# EAGLE design schematics (EAGLE 9.6.0)
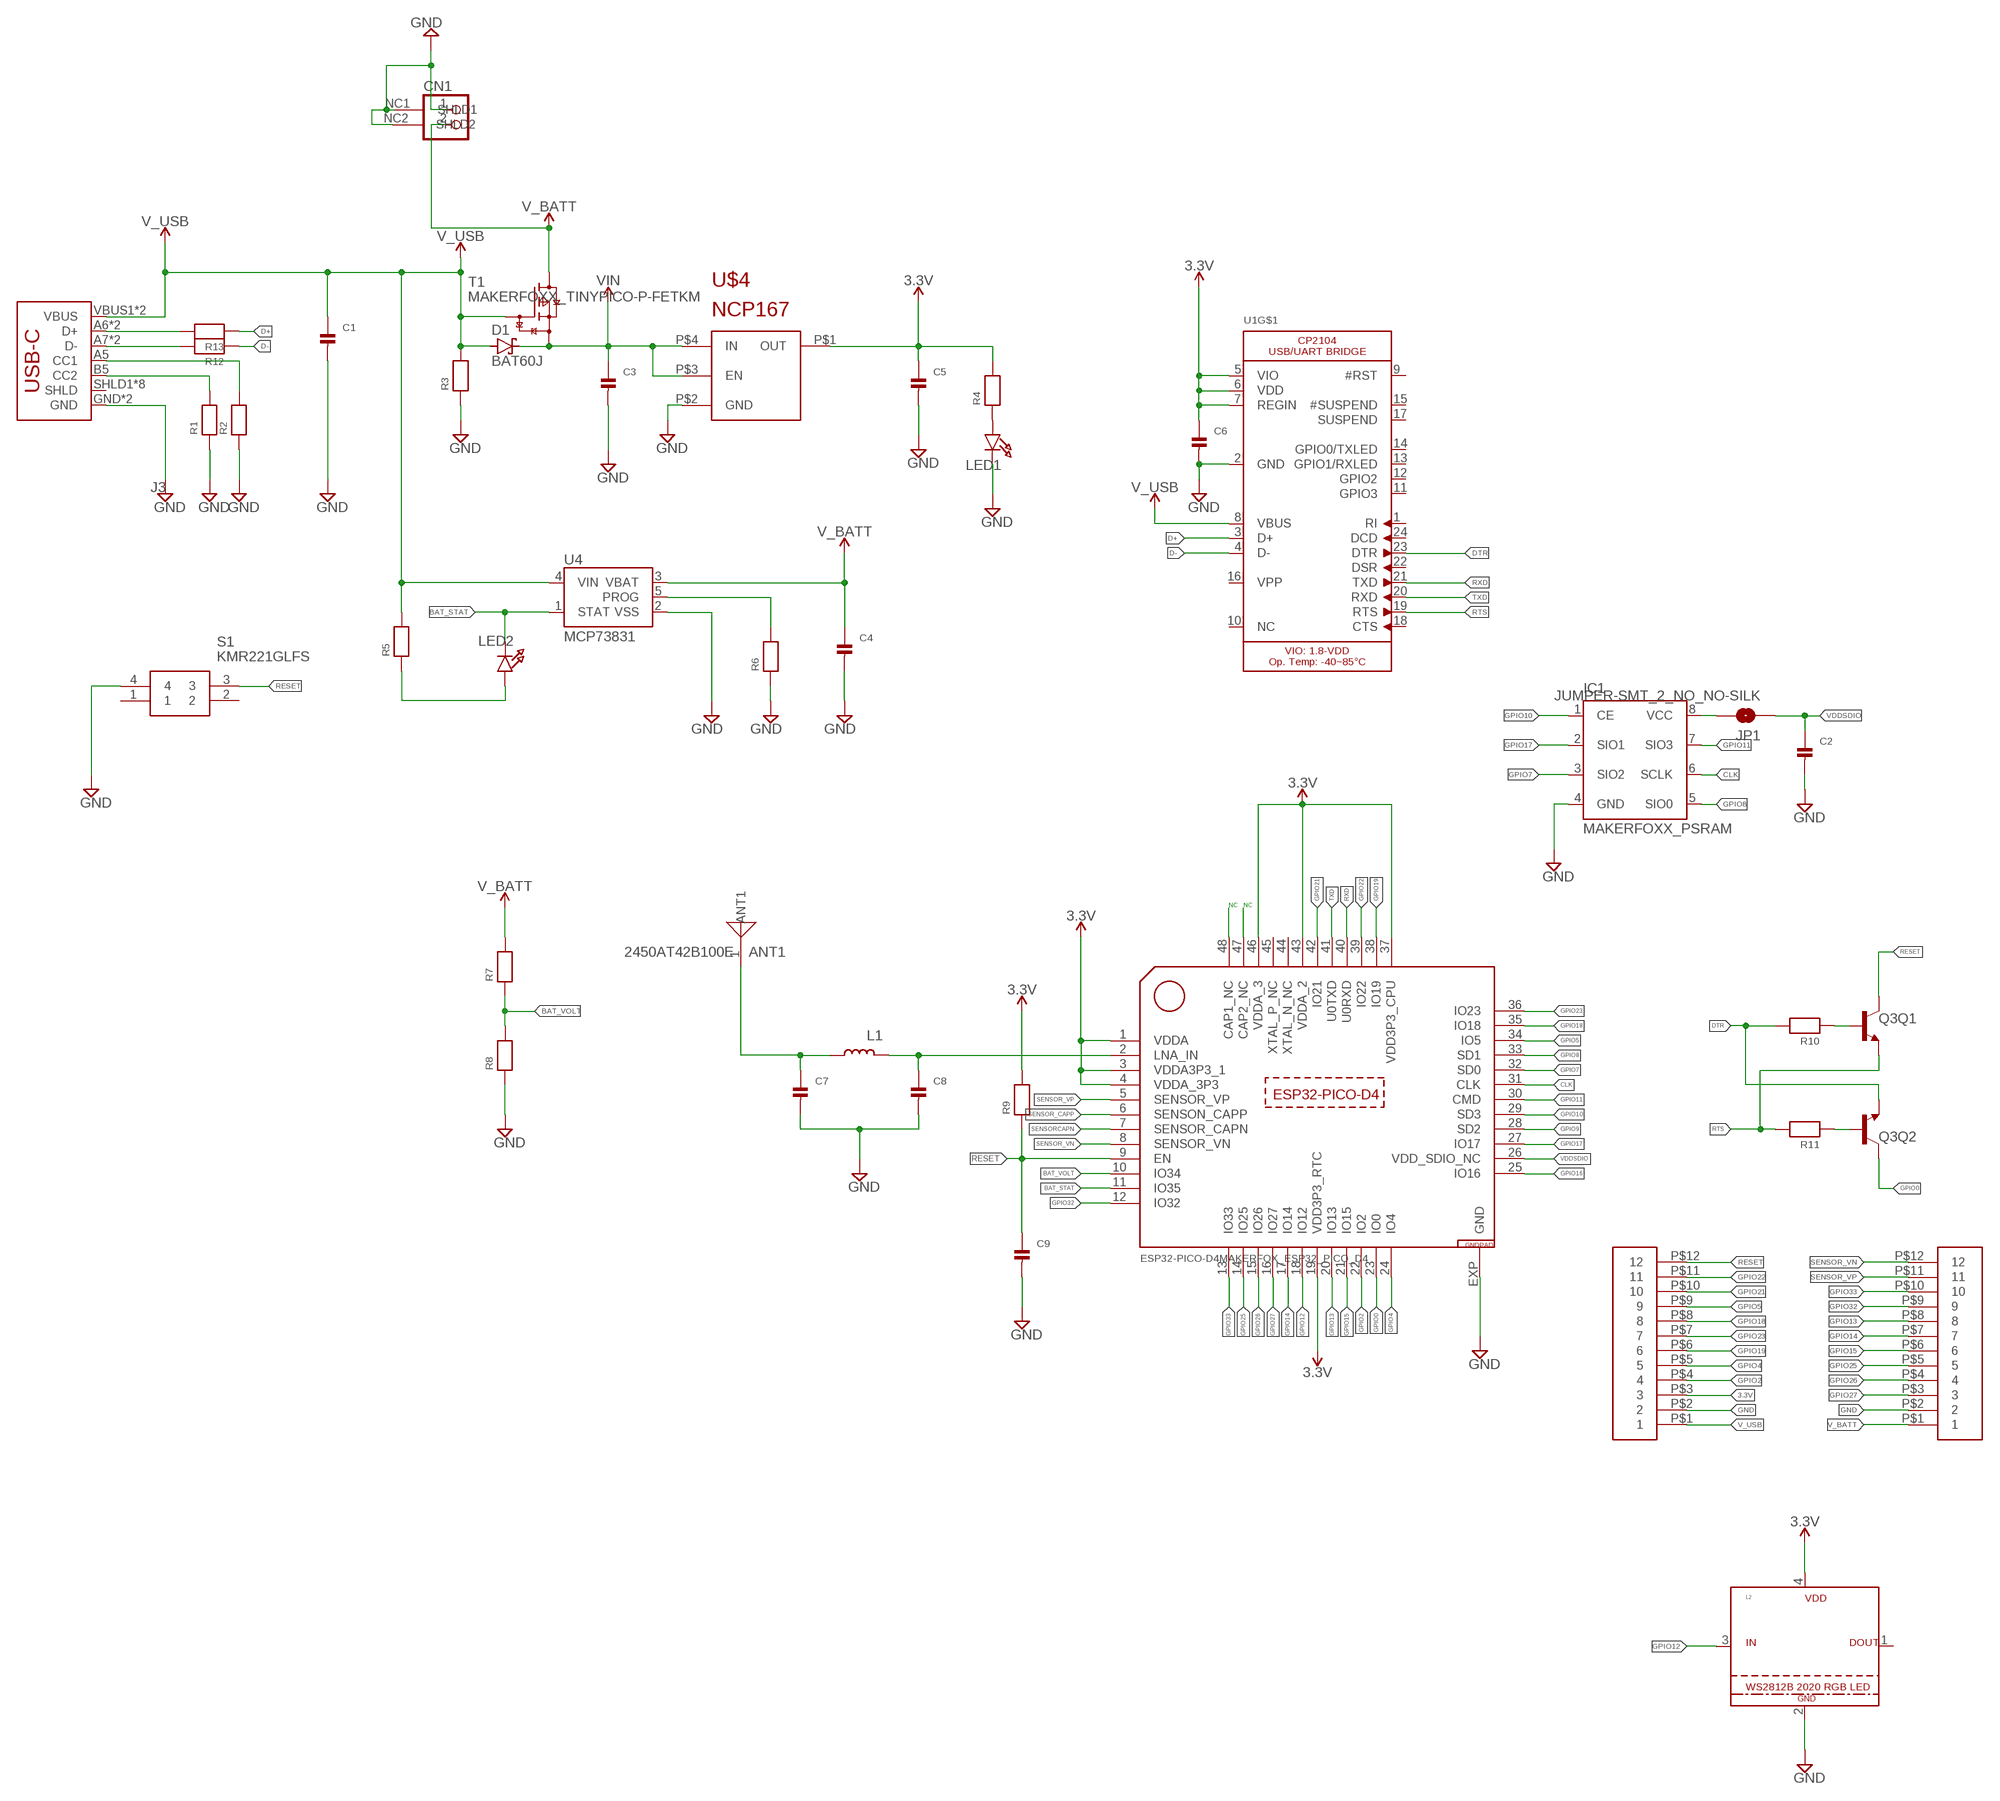
[diagram p0: schematic, sheet 1]

## Parts
ANT1  2450AT42B100E  [2450AT42B100E]
C1  CAP_CERAMIC_0603MP  [_0603MP]
C2  CAP_CERAMIC_0402MP  [_0402MP]
C3  CAP_CERAMIC_0402MP  [_0402MP]
C4  CAP_CERAMIC_0402MP  [_0402MP]
C5  CAP_CERAMIC_0402MP  [_0402MP]
C6  CAP_CERAMIC_0603MP  [_0603MP]
C7  CAP_CERAMIC_0402MP  [_0402MP]
C8  CAP_CERAMIC_0402MP  [_0402MP]
C9  CAP_CERAMIC_0402MP  [_0402MP]
CN1  STANDARD_JST_2PINSH2  [MAKERFOXX_JSTSH2]
D1  BAT60J  [SOD323_ST]
IC1  MAKERFOXX_PSRAM  [MAKERFOXX_SOP8]
J3  USBC_USB_C5  [USBC_USB-C-16P-5]
JP1  JUMPER-SMT_2_NO_NO-SILK  [SMT-JUMPER_2_NO_NO-SILK]
L1  3.9NH  INDUCTOR_0402MP  [_0402MP]
L2  DISCRETE_NOA_WS2812B2020  [DISCRETE_NOA_WS2812_2020]
LED1  LED0603_NOOUTLINE  [CHIPLED_0603_NOOUTLINE]
LED2  LED0603_NOOUTLINE  [CHIPLED_0603_NOOUTLINE]
Q3  MAKERFOXX_MBT3904DW1T1  [MAKERFOXX_DUAL_NPN_SC70-6]
R1  RESISTOR_0402MP  [_0402MP]
R2  RESISTOR_0402MP  [_0402MP]
R3  RESISTOR_0402MP  [_0402MP]
R4  RESISTOR_0402MP  [_0402MP]
R5  RESISTOR_0402MP  [_0402MP]
R6  RESISTOR_0402MP  [_0402MP]
R7  RESISTOR_0402MP  [_0402MP]
R8  RESISTOR_0402MP  [_0402MP]
R9  RESISTOR_0402MP  [_0402MP]
R10  RESISTOR_0402MP  [_0402MP]
R11  RESISTOR_0402MP  [_0402MP]
R12  RESISTOR_0402MP  [_0402MP]
R13  RESISTOR_0402MP  [_0402MP]
S1  KMR221GLFS  [KMR2_1]
T1  MAKERFOXX_TINYPICO-P-FETKM  [MAKERFOXX_SOT883(B)]
U1  CP2104_MICROBUILDER_CP2104  [CP2104_MICROBUILDER_QFN24_4MM_SMSC]
U4  MCP73831  [SOT23-5]
U$1  ESP32-PICO-D4MAKERFOX_ESP32_PICO_D4  [MAKERFOXX_PICO-D4-QFN48]
U$2  MAKEERFOXX_HEADER_12  [HEADER_12_NO_SILK]
U$3  MAKEERFOXX_HEADER_12  [HEADER_12_NO_SILK]
U$4  NCP167  [XDFN4]

## Nets
3.3V: C5.1 C6.1 L2.4(VDD) R4.2 R9.2 U1.5(VIO) U1.6(VDD) U1.7(REGIN) U$1.1(VDDA) U$1.3(VDDA3P3_1) U$1.4(VDDA_3P3) U$1.19(VDD3P3_RTC) U$1.37(VDD3P3_CPU) U$1.43(VDDA_2) U$1.46(VDDA_3) U$3.P$3 U$4.P$1(OUT)
BAT_STAT: LED2.C U4.1(STAT) U$1.11(IO35)
BAT_VOLT: R7.1 R8.2 U$1.10(IO34)
CLK: IC1.6(SCLK) U$1.31(CLK)
D+: R13.1 U1.3(D+)
D-: R12.1 U1.4(D-)
DTR: Q3.1(Q2:E) R10.2 U1.23(DTR)
GND: C1.2 C2.2 C3.2 C4.2 C5.2 C6.2 C7.2 C8.2 C9.2 CN1.1 CN1.NC1(SHLD1) CN1.NC2(SHLD2) IC1.4(GND) J3.GND J3.GND2(GND) L2.2(GND) LED1.C R1.1 R2.1 R3.1 R6.1 R8.1 S1.4 U1.2(GND) U4.2(VSS) U$1.EXP(GND) U$2.P$2 U$3.P$2 U$4.P$2(GND)
GPIO0: Q3.6(Q2:C) U$1.23(IO0)
GPIO2: U$1.22(IO2) U$3.P$4
GPIO4: U$1.24(IO4) U$3.P$5
GPIO5: U$1.34(IO5) U$3.P$9
GPIO7: IC1.3(SIO2) U$1.32(SD0)
GPIO8: IC1.5(SIO0) U$1.33(SD1)
GPIO9: U$1.28(SD2)
GPIO10: IC1.1(CE) U$1.29(SD3)
GPIO11: IC1.7(SIO3) U$1.30(CMD)
GPIO12: L2.3(DIN) U$1.18(IO12)
GPIO13: U$1.20(IO13) U$2.P$8
GPIO14: U$1.17(IO14) U$2.P$7
GPIO15: U$1.21(IO15) U$2.P$6
GPIO16: U$1.25(IO16)
GPIO17: IC1.2(SIO1) U$1.27(IO17)
GPIO18: U$1.35(IO18) U$3.P$8
GPIO19: U$1.38(IO19) U$3.P$6
GPIO21: U$1.42(IO21) U$3.P$10
GPIO22: U$1.39(IO22) U$3.P$11
GPIO23: U$1.36(IO23) U$3.P$7
GPIO25: U$1.14(IO25) U$2.P$5
GPIO26: U$1.15(IO26) U$2.P$4
GPIO27: U$1.16(IO27) U$2.P$3
GPIO32: U$1.12(IO32) U$2.P$9
GPIO33: U$1.13(IO33) U$2.P$10
IN: C3.1 D1.C T1.2(S) U$4.P$3(EN) U$4.P$4(IN) ; supply symbol labelled VIN
N$1: LED2.A R5.1
N$2: IC1.8(VCC) JP1.2
N$4: Q3.5(Q1:B) R10.1
N$5: R6.2 U4.5(PROG)
N$6: LED1.A R4.1
N$7: Q3.2(Q2:B) R11.1
N$11: C8.1 L1.2 U$1.2(LNA_IN)
N$12: ANT1.1(ANT1) C7.1 L1.1
N$16: J3.A7(D-) J3.B7(D-) R12.2
N$31: U$1.48(CAP1_NC)
N$32: U$1.47(CAP2_NC)
N$33: J3.A6(D+) J3.B6(D+) R13.2
N$34: J3.A5(CC1) R2.2
N$35: J3.B5(CC2) R1.2
RESET: C9.1 Q3.3(Q1:C) R9.1 S1.3 U$1.9(EN) U$3.P$12
RTS: Q3.4(Q1:E) R11.2 U1.19(RTS)
RXD: U1.21(TXD) U$1.40(U0RXD)
SENSOR_CAPP: U$1.6(SENSON_CAPP)
SENSOR_VN: U$1.8(SENSOR_VN) U$2.P$12
SENSOR_VP: U$1.5(SENSOR_VP) U$2.P$11
SENSORCAPN: U$1.7(SENSOR_CAPN)
TXD: U1.20(RXD) U$1.41(U0TXD)
V_BATT: C4.1 CN1.2 R7.2 T1.3(D) U4.3(VBAT) U$2.P$1
V_USB: C1.1 D1.A J3.VBUS1(VBUS) J3.VBUS2(VBUS) R3.2 R5.2 T1.1(G) U1.8(VBUS) U4.4(VIN) U$3.P$1
VDDSDIO: C2.1 JP1.1 U$1.26(VDD_SDIO_NC)
Unconnected: J3.SHLD1(SHLD) J3.SHLD2(SHLD) J3.SHLD3(SHLD) J3.SHLD4(SHLD) J3.SHLD5(SHLD) J3.SHLD6(SHLD) J3.SHLD7(SHLD) J3.SHLD8(SHLD) L2.1(DOUT) S1.1 S1.2 U1.1(RI) U1.9(#RST) U1.10(NC) U1.11(GPIO3) U1.12(GPIO2) U1.13(GPIO1/RXLED) U1.14(GPIO0/TXLED) U1.15(#SUSPEND) U1.16(VPP) U1.17(SUSPEND) U1.18(CTS) U1.22(DSR) U1.24(DCD) U$1.44(XTAL_N_NC) U$1.45(XTAL_P_NC)

## Notes on the sheet
- NC | NC

## Power pins joined to a net without a drawn wire
TP: U1.THERM(TP)

## Library data of the parts
ANT1 = SamacSys_Parts:2450AT42B100E: 2450 MHz Small SMD Chip Antenna Source: Datasheet <https://www.johansontechnology.com/datasheets/antennas/2450AT42B100.pdf>; DESCRIPTION: 2450 MHz Small SMD Chip Antenna; HEIGHT: mm; MANUFACTURER_NAME: JOHANSON TECHNOLOGY; MANUFACTURER_PART_NUMBER: 2450AT42B100E; MOUSER_PART_NUMBER: 609-2450AT42B100E; MOUSER_PRICE-STOCK: https://www.mouser.com/Search/Refine.aspx?Keyword=609-2450AT42B100E
C1-C9 = Microbuilder:CAP_CERAMIC: Ceramic Capacitors 0402 - 0402 Surface Mount Capacitors 16pF 50V 5% [Digikey: 445-4899-2-ND] 18pF 50V 5% [Digikey: 490-1281-2-ND] 22pF 50V 5% [Digikey: 490-1283-2-ND] 68pF 50V 5% [Digikey: 490-1289-2-ND] 0.1uF 10V 10% [Digikey: 490-1318-2-ND] 1.0uF 6.3V 10% [Digikey: 490-1320-2-ND] 0603 - 0603 Surface Mount Capacitors 16 pF 50V 5% [Digikey: 445-5051-2-ND] 22 pF 50V [Digikey: PCC220ACVTR-ND] 33 pF 50V 5% [Digikey: 490-1415-1-ND] 56pF 50V 5% [Digikey: 490-1421-1-ND] 220pF 50V 5% [Digikey: 445-1285-1-ND] 680 pF 50V 2200 pF 50V 5% C0G [Digikey: 445-1297-1-ND] 5600 pF 100V 5% X7R [Digikey: 478-3711-1-ND] 0.1 µF 25V 10% [Digikey: PCC2277TR-ND] 0.22 µF 16V 10% X7R [Digikey: 445-1318-1-ND] 1.0 µF 25V 10% [Digikey: 445-5146-2-ND] 0603 - RF Specific 3pF 250V +/-0.1pF RF [Digikey: 712-1347-1-ND] 18 pF 250V 5% [Digikey: 478-3505-1-ND or 712-1322-1-ND] 56 pF 250V 5% C0G RF [Digikey: 490-4867-1-ND] 68 pF 250V RF [Digikey: 490-4868-1-ND] 0805 - 0805 Surface Mount Capacitors 220 pF 250V 2% RF Ceramic Capacitor [Digikey: 712-1398-1-ND] 1000 pF 50V 2% NP0 Ceramic Capacitor [Digikey: 478-3760-1-ND] 0.1 µF 25V 10% Ceramic Capacitor [Digikey: PCC1828TR-ND] 1.0 µF 16V 10% Ceramic Capacitor[Digikey: 490-1691-2-ND] 10.0 µF 10V 10% Ceramic Capacitor[Digikey: 709-1228-1-ND] 10.0 uF 16V 10% Ceramic Capacitor [Digikey: 478-5165-2-ND] 47 uF 6.3V 20% Ceramic Capacitor [Digikey: 587-1779-1-ND or 399-5506-1-ND] 1206 - 1206 Surface Mount Capacitors 47uF 10V 20% Ceramic Capacitor [Digikey: 490-5528-1-ND or 399-5508-1-ND or 445-6010-1-ND] 100uF 6.3V -20%, +80% Y5V Ceramic Capacitor (Digikey: 490-4512-1-ND, Mouser: 81-GRM31CF50J107ZE1L)
CN1 = MAKKERFOXX:STANDARD_JST_2PIN: JST 2-Pin Right-Angle Connector PH-Series - 4UConnector: 17311 SH-Series - 4UConnector: 07278
D1 = diode:BAT60J: Schottky barrier diode Source: www.st.com, BAT60J.pdf
IC1 = MAKKERFOXX:MAKERFOXX_PSRAM: H-bridge driver for brush motors Source: http://www.rohm.com/products/databook/motor/pdf/bd623x_series-e.pdf
J3 = SparkFun_USB_C:USBC_USB_C: USB Type C 16Pin Connector Super Speed pins not available on the 16-pin purely SMD connector so this part is best for USB 2.0 implementations. D1 and D2 are tied together enabling D+/- no matter which way the cable is plugged into the connector. The two channel configuration pins (CC1/2) are exposed. These are normally connected to ground via 5.1k resistors but can be reconfigured for high current/high power applications.; SPICEPREFIX: X
JP1 = SparkFun-Jumpers:JUMPER-SMT_2_NO: Normally open jumper This jumper has two pads in close proximity to each other. Apply solder to close the connection. Round pads are easier to solder for beginners, but are a lot larger. SparkFun Product that uses the round pads: SparkFun EL Sequencer <https://www.sparkfun.com/products/12781>
L1 = Microbuilder:INDUCTOR: Inductors 0603: 10nH Ceramic Inductor - microwire antenna/RF (Digikey: 712-1434-2-ND) 0805: 560nH Ceramic Inductor - RF (Digikey: 553-1047-1-ND) 270nH Ceramic Inductor - Q = 40@250MHz, +-5%, 1 Ohm DC Resistance (Digikey: 535-10506-2-ND) 1007 (2518 Metric) SMT: 10µH 10% 250mOhm 820mA 1007 Inductor (Digikey: 587-2189-1-ND) 22µH 10% 500mOhm 580mA 1007 Inductor (Digikey: 587-2190-1-ND) 47µH 10% 950mOhm 420mA 1007 Inductor (Digikey: 587-2191-1-ND) 47µH 5% 100mOhm 1A 1008 Inductor (Digikey: 732-1816-1-ND) 5.0x5.0mm (Taiyo Yuden NR5040 Series) 6.8µH 20% 2.3A 64mOhm Inductor (Digikey: 587-2374-2-ND) 5.0x5.0mm (TDK VLC5045 Series) 4.7µH 20% 3.3A 34mOhm Inductor (Digikey: 445-6526-1-ND) 6.8µH 20% 2.7A 46mOhm Inductor (Digikey: 445-6527-1-ND) 6.0x6.0mm (TDK VLC6045 Series) 4.7µH 20% 3.8A 27mOhm Inductor (Digikey: 445-6538-2-ND) 6.8µH 20% 3A 41mOhm Inductor (Digikey: 445-6540-1-ND) 6.2µH 30% 2.2A 45mOhm Inductor (Digikey: SRR5028-6R2YCT-ND) - Not TDK VLC6045 but footprint should match 6.0x6.0mm (TDK SLF6045 Series) 6.8uH 30% 2A 33mOhm Inductor (Digikey: 445-4572-1-ND, Mouser: 810-SLF645T6R8N2R0PF)
L2 = WS2812_2020LED:DISCRETE_NOA_WS2812B
LED1 LED2 = Microbuilder:LED: LED 0603 - 0603 Surface Mount Package 2mA: Green LED - Low Power (3.9mcd, 2ma, 1.7Vf) - Digikey: 475-2709-2-ND Orange LED - Low Power (9.8mcd, 2ma, 1.8Vf) - Digikey: 475-1194-2-ND Red LED - Low Power (5mcd, 2ma, 1.8Vf) - Digikey: 475-1195-2-ND Yellow LED - Low Power (7mcd, 2ma, 1.8Vf) - Digikey: 475-1196-2-ND 5mA: Blue LED - Low Power (17mcd, 5ma, 2.9Vf) - Digikey: LNJ937W8CRACT-ND 0805 - 0805 Surface Mount Package 2mA: Red LED (8.8mcd, 2mA, 1.8Vf, Clear) - Low Power [Digikey: 475-2510-1-ND] Green LED (5mcd, 2mA, 1.8Vf, Clear) - Low Power [Digikey: 475-2730-1-ND] Yellow LED (11.3mcd, 2mA, 1.8Vf, Clear) - Low Power [Digikey: 475-2555-1-ND] 20mA: Red LED (104mcd, 20mA, Diffused) - LS R976 [Digikey: 475-1278-6-ND] Red LED (12mcd, 20mA, 2.0Vf, Clear) - APT2012EC [Digikey: 754-1128-1-ND] Green LED (15mcd, 20mA, 2.2Vf, Clear) - APT2012GC [Digikey: 754-1131-1-ND] Orange LED (160mcd, 20mA, 2.1Vf, Clear) - APT2012SECK [Digikey: 754-1130-1-ND] 1206 - 1206 Surface Mount Package Green LED (26mcd, 20mA, Diffused) - LG N971 [Digikey: 475-1407-6-ND] Red LED (15mcd, 20mA, Diffused) - LH N974 [Digikey: 475-1416-6-ND]
Q3 = MAKKERFOXX:MAKERFOXX_MBT3904DW1T1: MBT3904DW1 Dual NPN Transistors The MBT3904W1 puts two general purpose 3904 NPN transistors in a single package. Datasheet <http://www.onsemi.com/pub_link/Collateral/MBT3904DW1T1-D.PDF>; PROD_ID: TRANS-13337
R1-R13 = Microbuilder:RESISTOR: Resistors 0402 - 0402 Surface Mount Package 22 Ohm 1% 1/16W [Digikey: 311-22.0LRTR-ND] 33 Ohm 5% 1/16W 1.0K 5% 1/16W 1.5K 5% 1/16W 2.0K 1% 1/16W 10.0K 1% 1/16W [Digikey: 311-10.0KLRTR-ND] 10.0K 5% 1/16W [Digikey: RMCF0402JT10K0TR-ND] 12.1K 1% 1/16W [Digikey: 311-22.0LRTR-ND] 100.0K 5% 1/16W 0603 - 0603 Surface Mount Package 0 Ohm 1/10 Watt 1% Resistor 15 Ohm 1/10 Watt 1% Resistor 33 Ohm 1/10 Watt 1% Resistor 49.9 Ohm 1/10 Watt 1% Resistor 100 Ohm 1/10 Watt 1% Resistor 150 Ohm 1/10 Watt 1% Resistor 240 Ohm 1/10 Watt 1% Resistor 390 Ohm 1/10 Watt 1% Resistor 560 Ohm 1/10 Watt 1% Resistor 680 Ohm 1/10 Watt 1% Resistor 750 Ohm 1/10 Watt 1% Resistor 1.0K Ohm 1/10 Watt 1% Resistor 1.5K Ohm 1/10 Watt 1% Resistor 2.0K Ohm 1/10 Watt 1% Resistor 2.2K Ohm 1/10 Watt 1% Resistor 3.3K Ohm 1/10 Watt 1% Resistor 4.7K Ohm 1/10 Watt 1% Resistor 10.0K Ohm 1/10 Watt 1% Resistor 12.0K Ohm 1/10 Watt 1% Resistor 12.1K Ohm 1/10 Watt 1% Resistor 20.0K Ohm 1/10 Watt 1% Resistor 33.0K Ohm 1/10 Watt 1% Resistor 100.0K Ohm 1/10 Watt 1% Resistor 0805 - 0805 Surface Mount Package 0 Ohm 1/8 Watt 1% Resistor 33 Ohm 1/8 Watt 1% Resistor 100 Ohm 1/8 Watt 1% Resistor 150 Ohm 1/8 Watt 1% Resistor 200 Ohm 1/8 Watt 1% Resistor 240 Ohm 1/8 Watt 1% Resistor 330 Ohm 1/8 Watt 1% Resistor 390 Ohm 1/8 Watt 1% Resistor 470 Ohm 1/8 Watt 1% Resistor 1.0K Ohm 1/8 Watt 1% Resistor 1.5K Ohm 1/8 Watt 1% Resistor 2.0K Ohm 1/8 Watt 1% Resistor 4.7K Ohm 1/8 Watt 1% Resistor 5.1K Ohm 1/8 Watt 1% Resistor 5.6K Ohm 1/8 Watt 1% Resistor 10.0K Ohm 1/8 Watt 1% Resistor 22.0K Ohm 1/8 Watt 1% Resistor 33.0K Ohm 1/8 Watt 1% Resistor 100K Ohm 1/8 Watt 1% Resistor 1206 - 1206 Surface Mount Package 2012 - 2010 Surface Mount Package 0.11 Ohm 1/2 Watt 1% Resistor - Digikey: RHM.11UCT-ND
S1 = SamacSys_Parts:KMR221GLFS: KMR221GLFS (Tactile Switches) Source: Datasheet <https://componentsearchengine.com/Datasheets/1/KMR221GLFS.pdf>; DESCRIPTION: KMR221GLFS (Tactile Switches); HEIGHT: mm; MANUFACTURER_NAME: C & K COMPONENTS; MANUFACTURER_PART_NUMBER: KMR221GLFS; MOUSER_PART_NUMBER: 611-KMR221G-LFS; MOUSER_PRICE-STOCK: https://www.mouser.com/Search/Refine.aspx?Keyword=611-KMR221G-LFS
T1 = MAKKERFOXX:MAKERFOXX_TINYPICO-P-FET: 50 V, 150 mA P-channel Trench MOSFET P-channel enhancement mode Field-Effect Transistor (FET) in a small Surface-Mounted Device (SMD) plastic package using Trench MOSFET technology. AAL Eindhoven MK
U1 = MAKKERFOXX:CP2104_MICROBUILDER_CP2104: CP2104 - USB to UART Bridge VDD Output: 3.45V
U4 = SparkFun-IC-Power:MCP73831: MCP73831T Li-Ion, Li-Pol Controller Miniature single cell, fully integrated Li-Ion, Li-polymer charge management controller Datasheet <http://ww1.microchip.com/downloads/en/DeviceDoc/20001984g.pdf> SparkFun Products: SparkFun ESP32 Thing <https://www.sparkfun.com/products/13907> SparkFun 9DoF Razor IMU M0 <https://www.sparkfun.com/products/14001>; PROD_ID: IC-09995
U$1 = ESP32-PICO-D4:ESP32-PICO-D4
U$2 U$3 = MAKKERFOXX:MAKEERFOXX_HEADER_12
U$4 = NCP167B:NCP167: 700 mA, Ultra-Low Noise and High PSRR LDO Regulator for RF and Analog Circuits

## Board
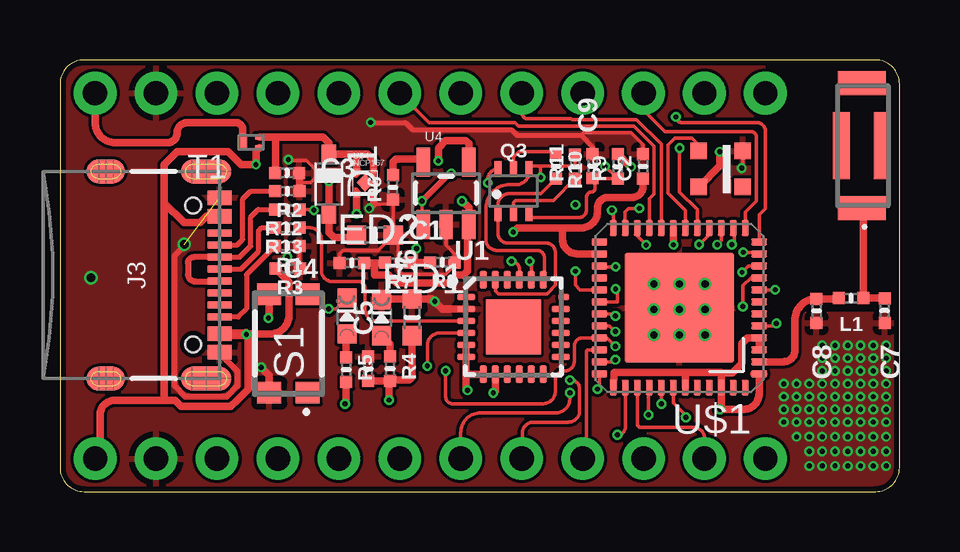
[diagram p1: board, top side]
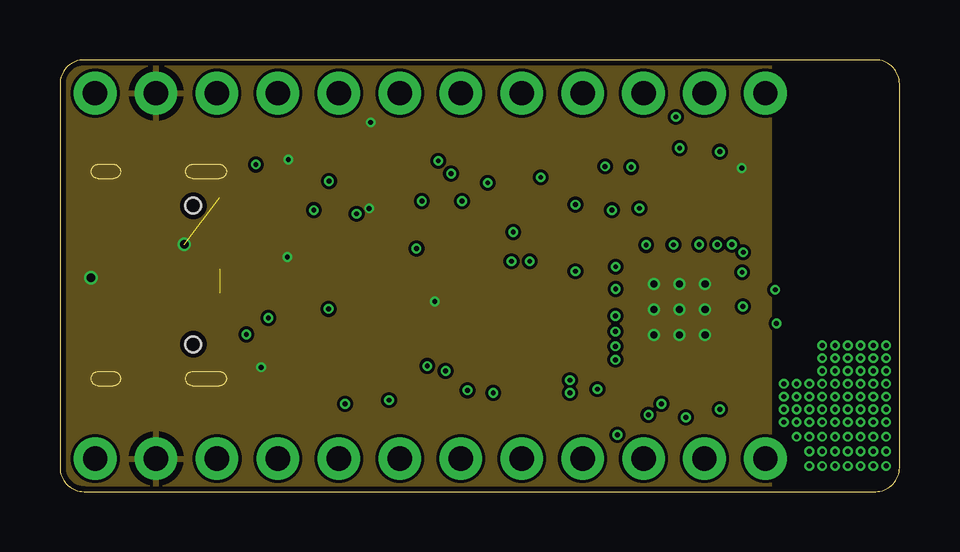
[diagram p2: board, inner layer GND]
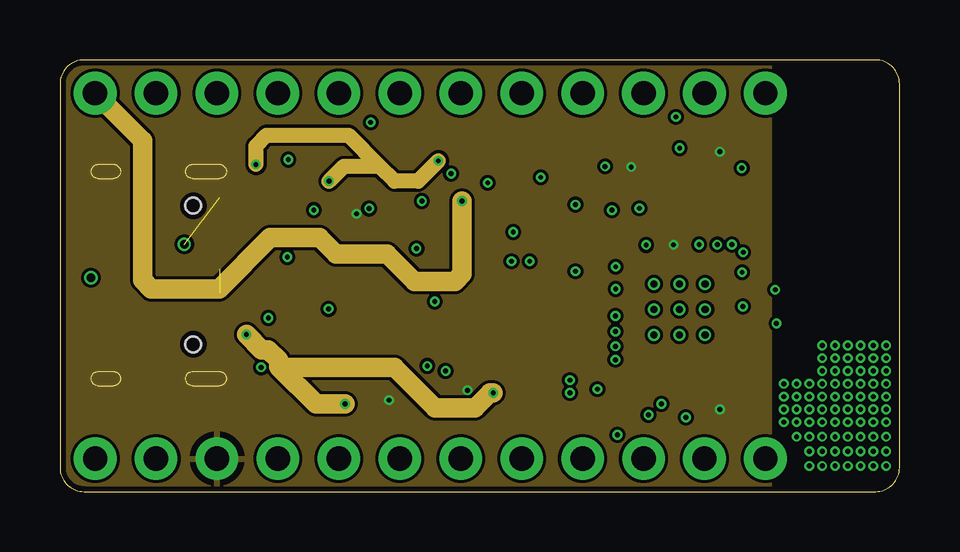
[diagram p3: board, inner layer 3.3V]
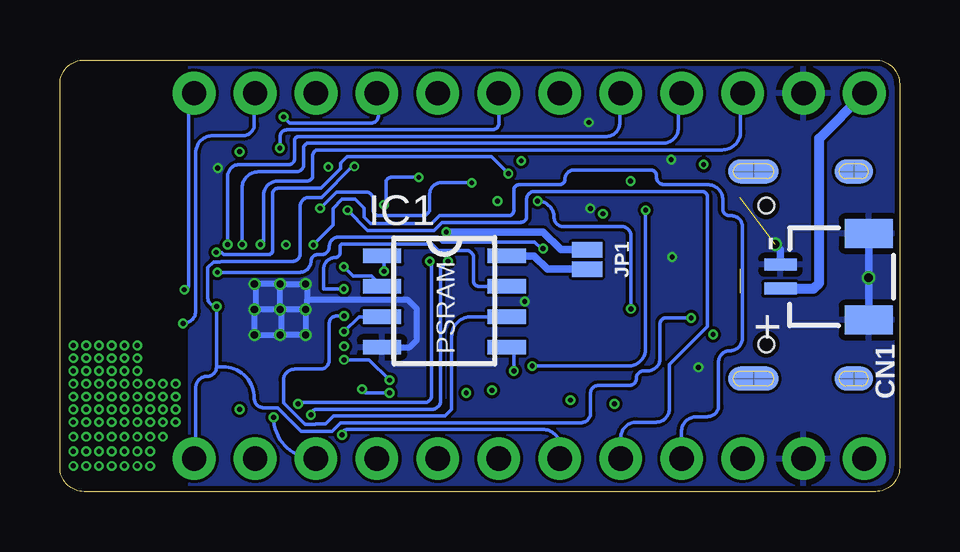
[diagram p4: board, bottom side, seen from below]

Size 35 x 18 mm. Coordinates in mm from the lower left corner, seen from the top.
Outline: 35,17 arc90 34,18 1,18 arc90 0,17 0,1 arc90 1,0 34,0 arc90 35,1 35,17
Copper layers (1+2*15+16): Top 0.035mm / dielectric 0.18mm / GND 0.017mm / dielectric 1.12mm / 3.3V 0.017mm / dielectric 0.18mm / Bottom 0.035mm
Design rules "default *": minimum track width 5mil, minimum drill 7mil, track to track 5mil, track to pad 5mil, pad to pad 5mil, via to via 5mil, smd to smd 5mil, copper to edge 9mil, drill to drill 6mil, minimum pad ring 4mil, minimum via ring 4mil, stop-mask expansion 1.25mil, vias tented up to drill 12mil, thermal gap 10mil

### Footprints (pad centres in the part's own frame; a part is rotated, then mirrored left to right if it is on the bottom)
2450AT42B100E = smd 1 x 2: 1 2.6,0; 2 -2.6,0 | smd 2.8 x 0.7: 3 0,0.85; 4 0,-0.85
_0603MP = smd 0.8 x 0.8: 1 -0.762,0; 2 0.762,0
_0402MP = smd 0.5 x 0.5: 1 -0.508,0; 2 0.508,0
MAKERFOXX_JSTSH2 = smd 0.5 x 1.35: 1 -0.5,-2.55; 2 0.5,-2.55 | smd 1.2 x 2: NC1 -1.8,1.125; NC2 1.8,1.125
SOD323_ST = smd 0.8 x 0.6: A 1.25,0; C -1.25,0
MAKERFOXX_SOP8 = smd 0.6 x 1.6: 1 -1.905,-2.6; 2 -0.635,-2.6; 3 0.635,-2.6; 4 1.905,-2.6; 5 1.905,2.6; 6 0.635,2.6; 7 -0.635,2.6; 8 -1.905,2.6
USBC_USB-C-16P-5 = smd 0.3 x 1: A5 -1.25,-0.34; A6 -0.25,-0.34; A7 0.25,-0.34; A8 1.25,-0.34; B5 1.75,-0.34; B6 0.75,-0.34; B7 -0.75,-0.34; B8 -1.75,-0.34 | smd 0.6 x 1: GND -3.225,-0.34; GND2 3.225,-0.34; VBUS1 -2.45,-0.34; VBUS2 2.45,-0.34 | smd 1 x 2.1: SHLD1 -4.32,-0.915; SHLD2 4.32,-0.915 | smd 1 x 2.1 bottom: SHLD3 -4.32,-0.915; SHLD4 4.32,-0.915 | smd 1 x 1.6: SHLD5 -4.32,-5.095; SHLD8 4.32,-5.095 | smd 1 x 1.6 bottom: SHLD6 -4.32,-5.095; SHLD7 4.32,-5.095 | hole 0.65: -2.89,-1.445; 2.89,-1.445
SMT-JUMPER_2_NO_NO-SILK = smd 0.635 x 1.27: 1 -0.406,0; 2 0.406,0
DISCRETE_NOA_WS2812_2020 = smd 0.7 x 0.7: 1 0.915,-0.75; 2 0.915,0.75; 3 -0.915,0.75; 4 -0.915,-0.75
CHIPLED_0603_NOOUTLINE = smd 0.8 x 0.8: A 0,-0.75; C 0,0.75
MAKERFOXX_DUAL_NPN_SC70-6 = smd 0.3 x 0.66: 1 -0.65,-0.92; 2 0,-0.92; 3 0.65,-0.92; 4 0.65,0.92; 5 0,0.92; 6 -0.65,0.92
KMR2_1 = smd 0.9 x 1: 1 -2.05,-0.8; 2 2.05,-0.8; 3 2.05,0.8; 4 -2.05,0.8
MAKERFOXX_SOT883(B) = smd 0.4 x 0.25: 1 -0.35,0.225; 2 -0.35,-0.225 | smd 0.4 x 0.7: 3 0.35,0
CP2104_MICROBUILDER_QFN24_4MM_SMSC = smd 0.737 x 0.28: 1 -1.968,1.25; 2 -1.968,0.75; 3 -1.968,0.25; 4 -1.968,-0.25; 5 -1.968,-0.75; 6 -1.968,-1.25; 13 1.968,-1.25; 14 1.968,-0.75; 15 1.968,-0.25; 16 1.968,0.25; 17 1.968,0.75 | smd 0.28 x 0.737: 7 -1.25,-1.968; 8 -0.75,-1.968; 9 -0.25,-1.968; 10 0.25,-1.968; 11 0.75,-1.968; 12 1.25,-1.968; 19 1.25,1.968; 20 0.75,1.968; 21 0.25,1.968; 22 -0.25,1.968; 23 -0.75,1.968; 24 -1.25,1.968 | smd 0.457 x 0.28: 18 2.095,1.25 | smd 2.286 x 2.286: THERM 0,0
SOT23-5 = smd 0.55 x 1.2: 1 -0.95,-1.3; 2 0,-1.3; 3 0.95,-1.3; 4 0.95,1.3; 5 -0.95,1.3
MAKERFOXX_PICO-D4-QFN48 = smd 0.66 x 0.3: 1 -3.327,2.75; 2 -3.327,2.25; 3 -3.327,1.75; 4 -3.327,1.25; 5 -3.327,0.75; 6 -3.327,0.25; 7 -3.327,-0.25; 8 -3.327,-0.75; 9 -3.327,-1.25; 10 -3.327,-1.75; 11 -3.327,-2.25; 12 -3.327,-2.75; 25 3.327,-2.75; 26 3.327,-2.25; 27 3.327,-1.75; 28 3.327,-1.25; 29 3.327,-0.75; 30 3.327,-0.25; 31 3.327,0.25; 32 3.327,0.75; 33 3.327,1.25; 34 3.327,1.75; 35 3.327,2.25; 36 3.327,2.75 | smd 0.3 x 0.66: 13 -2.75,-3.327; 14 -2.25,-3.327; 15 -1.75,-3.327; 16 -1.25,-3.327; 17 -0.75,-3.327; 18 -0.25,-3.327; 19 0.25,-3.327; 20 0.75,-3.327; 21 1.25,-3.327; 22 1.75,-3.327; 23 2.25,-3.327; 24 2.75,-3.327; 37 2.75,3.327; 38 2.25,3.327; 39 1.75,3.327; 40 1.25,3.327; 41 0.75,3.327; 42 0.25,3.327; 43 -0.25,3.327; 44 -0.75,3.327; 45 -1.25,3.327; 46 -1.75,3.327; 47 -2.25,3.327; 48 -2.75,3.327 | smd 4.572 x 4.572: EXP 0,0
HEADER_12_NO_SILK = drill 1.016 pad 1.778: P$1 0,0; P$2 2.54,0; P$3 5.08,0; P$4 7.62,0; P$5 10.16,0; P$6 12.7,0; P$7 15.24,0; P$8 17.78,0; P$9 20.32,0; P$10 22.86,0; P$11 25.4,0; P$12 27.94,0
XDFN4 = smd 0.2 x 0.2: P$1 -0.355,-0.5; P$2 0.355,-0.5; P$3 0.355,0.5; P$4 -0.355,0.5 | smd 0.52 x 0.52 rotated 45: P$5 0,0

### Placement (x,y rotation side)
ANT1  33.42,14.42 270 top
C1  13.13,10.7 0 top
C2  24.31,13.56 90 top
C3  9.47,13.29 0 top
C4  12.17,9.53 180 top
C5  12.85,5.12 90 top
C6  14.67,7.26 90 top
C7  34.38,7.55 270 top
C8  31.54,7.53 270 top
C9  22.21,13.57 90 top
CN1  2.42,8.96 270 bottom
D1  11.21,12.83 270 top
IC1  18.97,7.92 270 bottom
J3  7,9.03 270 top
JP1  13.03,9.68 270 bottom
L1  32.98,8.06 180 top
L2  27.54,13.46 0 top
LED1  13.41,7.25 0 top
LED2  11.96,7.33 0 top
Q3  18.91,12.53 0 top
R1  9.48,10.24 180 top
R2  9.48,12.53 180 top
R3  9.5,9.3 180 top
R4  13.76,5.12 270 top
R5  11.93,5.08 270 top
R6  13.88,12.69 90 top
R7  14.07,9.54 180 top
R8  15.94,9.56 180 top
R9  23.25,13.56 90 top
R10  20.69,13.56 270 top
R11  21.47,13.55 90 top
R12  9.48,11.77 180 top
R13  9.48,11 180 top
S1  9.53,6.17 90 top
T1  7.97,14.57 180 top
U1  18.9,6.87 0 top
U4  16.09,12.44 0 top
U$1  25.82,7.67 180 top
U$2  1.47,16.61 0 top
U$3  1.47,1.37 0 top
U$4  12.73,12.88 0 top

### Tracks (layer width: path | path; a pad name or v marks a point on that pad's centre or on a via)
3.3V  (via drill 0.2)
  Top 0.305: R4.2 C5.1 | U$4.P$1 v12.37,11.59 v12.36,11.58 | U1.5 U1.6 16.93,4.94 | 16.93,4.94 16.99,4.88 17.63,4.88 U1.7 | 16.93,4.94 16.93,4.28 v16.99,4.22 | U$1.19 25.57,10.3 v25.58,10.29 | L2.4 27.51,13.58 v27.51,14.17 | 23.25,14.01 R9.2 23.79,13.54 v23.81,13.54 | U$1.3 U$1.4 28.67,6.42 28.42,6.17 28.42,5.33 28.04,4.95 27.57,4.95 | R4.2 13.76,4.54 13.72,4.5 v13.72,3.81 13.76,3.85 | U$1.43 26.07,4.96 | 27.57,4.95 U$1.46 27.57,3.49 arc-90 v27.51,3.43 28.5,3.43 arc90 29.15,4.08 U$1.1 | 29.34,4.92 U$1.1 | U$1.37 23.07,4.64 23.1,4.68 23.1,4.95 23.11,4.96 26.07,4.96 | C6.1 14.68,4.84 arc-90 14.48,4.65 13.79,4.65 arc90 R4.2 | 28.92,4.92 U$1.1 | 26.07,4.96 27.56,4.96 27.57,4.95
  pour 3.3V: -0.08,0 -0.08,18.14 6.17,18.14 29.64,18.14 29.64,-0.23 -0.08,-0.23
BAT_STAT  (via drill 0.2)
  Top 0.152: 14.93,11.35 U4.1 15.09,11.2 v15.09,12.12 15.09,12.19 | LED2.C 11.51,7.62 v11.2,7.62 | U$1.11 29.08,9.98 v28.48,9.98
  Top 0.254: v15.09,12.12 16.23,13.26 v16.31,13.26
  Bottom 0.152: v28.48,9.98 28.26,9.98 28.17,9.89 26.29,9.89 arc-90 26.14,10.04 26.14,12.42 arc90 25.91,12.65 24.12,12.65 23.3,13.46 23.3,13.71 23.04,13.97 17.02,13.97 v16.31,13.26 | v15.09,12.12 arc90 14.4,11.43 arc-90 14.02,11.05 11.58,11.05 arc90 11.2,10.67 v11.2,7.62
BAT_VOLT  (via drill 0.2)
  Top 0.152: U$1.10 28.7,9.41 v28.43,9.14 | v14.86,10.13 14.86,9.63 14.78,9.56
  Top 0.305: R7.1 14.59,9.56 14.78,9.56 R8.2
  Bottom 0.152: v14.86,10.13 14.94,10.13 15.22,10.42 19.07,10.42 19.26,10.61 23.37,10.61 arc-90 23.77,10.21 arc90 24.1,9.88 24.26,9.88 arc-90 24.54,9.6 arc90 24.99,9.14 v28.43,9.14
CLK  (via drill 0.2)
  Top 0.152: v23.16,7.32 23.06,7.42 U$1.31
  Bottom 0.152: v23.16,7.32 23.46,7.32 arc-90 23.77,7.01 23.77,5.49 arc90 24.16,5.11 25.22,5.11 arc-90 25.68,4.65 25.68,3.69 24.78,2.8 24.37,2.8 24.34,2.82 23.93,2.82 23.6,3.15 18.95,3.15 18.67,3.43 18.67,6.48 arc90 17.86,7.29 IC1.6
D+
  Top 0.152: R13.1 10.41,11.01 arc-90 10.9,10.52 10.9,9.22 arc90 11.35,8.76 12.42,8.76 arc-90 12.72,8.46 12.72,7.57 arc90 13.18,7.12 U1.3
D-  (via drill 0.2)
  Top 0.152: R12.1 10.55,11.77 v10.59,11.73 | U1.4 15.84,6.62 arc90 15.32,6.1 v15.32,5.23
  Bottom 0.152: v15.32,5.23 11.3,5.23 arc-90 10.59,5.94 arc-90 10.59,5.95 v10.59,11.73
DTR
  Top 0.152: 20.65,13.01 R10.2 20.06,12.42 18.72,12.42 arc90 18.26,11.96 Q3.1 18.26,10.78 arc90 18.67,10.36 20.27,10.36 arc-90 20.65,9.98 20.65,8.61 20.5,8.46 20.5,8.42 20.3,8.23 18.29,8.23 18.15,8.37 U1.23
GND  (via drill 0.2, 0.3, 0.35)  (1 unrouted)
  Top 0.152: U4.2 16.09,10.27 16.45,9.91 R8.1 16.45,9.44 16.07,9.06 14.27,9.06 14.1,9.23 14.1,10.5 C1.2 | C1.2 13.89,12.17 R6.1 13.69,12 13.08,12 | C4.2 11.66,9.91 11.81,10.06 13.26,10.06 C1.2 | C2.2 24.31,14.46 23.81,14.96 21.82,14.96 21.72,14.86 | 22.21,14.33 C9.2 | L2.2 28.46,13.52 v28.42,13.49 | R1.1 9.99,9.32 R3.1 9.96,9.3 v9.48,9.78 | 9.98,13.32 C3.2 | 15.24,8.03 15.34,7.92 v15.62,7.92 | v9.52,13.84 9.57,13.79 10.29,13.79 10.63,13.45 10.63,13.07 10.44,12.88 9.99,12.88
  Top 0.203: v12.95,15.39 14.4,15.39 14.71,15.09 18.82,15.09 19.05,14.86 21.72,14.86 22.21,14.37 22.21,14.33
  Top 0.254: v5.18,10.31 5.18,10.24 4.79,9.84 4.79,4.4 5.23,3.96 6.95,3.96 7.39,4.4 7.39,5.02 6.66,5.75 J3.GND2
  Top 0.305: C3.2 9.99,13.28 9.99,12.88 R2.1 | U$4.P$2 13.08,12 v12.89,11.81 | U1.2 15.93,7.62 v15.62,7.92 15.52,8.03 15.24,8.03 C6.2 13.44,8.03 LED1.C | S1.4 8.72,4.84 v8.38,5.18
  Bottom 0.254: IC1.4 20.42,6.02 20.12,6.33 20.12,7.62 20.49,7.99 23.35,7.99 23.36,8 24.69,8 | 24.69,8 24.69,8.59 v24.76,8.66 v25.83,8.66 | v24.76,7.59 24.69,7.67 24.69,8 | v24.76,7.59 v24.76,6.53 v25.83,6.53 | v25.83,6.53 v26.89,6.53 v26.89,7.59 | v25.83,7.59 v26.89,7.59 | v25.83,8.66 26.82,8.66 | 26.82,8.66 v26.89,8.66 | v24.76,7.59 25.76,7.59 | 25.76,7.59 v25.83,7.59 | v26.89,7.59 26.82,7.67 26.82,8.66 | v25.83,7.59 v25.83,8.66 | v25.83,6.53 25.76,6.6 25.76,7.59
  Bottom 0.305: CN1.NC2 v1.29,8.91 CN1.NC1 | CN1.1 4.97,10.1 v5.18,10.31
  other vias: 31.78,6.1 32.31,6.1 32.84,6.1 33.38,6.1 33.91,6.1 34.44,6.1 31.78,5.56 32.31,5.56 32.84,5.56 33.38,5.56 33.91,5.56 34.44,5.56 31.78,5.03 32.31,5.03 32.84,5.03 33.38,5.03 33.91,5.03 34.44,5.03 30.18,4.5 30.71,4.5 31.24,4.5 31.78,4.5 32.31,4.5 32.84,4.5 33.38,4.5 33.91,4.5 34.44,4.5 30.18,3.96 30.71,3.96 31.24,3.96 31.78,3.96 32.31,3.96 32.84,3.96 33.38,3.96 33.91,3.96 34.44,3.96 30.18,3.43 30.71,3.43 31.24,3.43 31.78,3.43 32.31,3.43 32.84,3.43 33.38,3.43 33.91,3.43 34.44,3.43 30.18,2.9 30.71,2.9 31.24,2.9 31.78,2.9 32.31,2.9 32.84,2.9 33.38,2.9 33.91,2.9 34.44,2.9 30.71,2.29 31.24,2.29 31.78,2.29 32.31,2.29 32.84,2.29 33.38,2.29 33.91,2.29 34.44,2.29 31.24,1.68 31.78,1.68 32.31,1.68 32.84,1.68 33.38,1.68 33.91,1.68 34.44,1.68 34.44,1.07 33.91,1.07 33.38,1.07 32.84,1.07 31.24,1.07 32.31,1.07 31.78,1.07
  pour GND: -0.08,0 -0.08,18.14 2.21,18.14 29.64,18.14 29.64,-0.15 -0.08,-0.15
  pour Top: -0.08,0 -0.08,18.14 29.34,18.14 29.34,-0.15 29.03,-0.15 -0.08,-0.15 -0.08,-0.08
  pour Top: 29.26,-0.46 29.26,7.47 35.2,7.47 35.2,-0.46
  pour Bottom: -0.08,-0.23 -0.08,18.21 2.36,18.21 29.64,18.21 29.64,-0.23
GPIO0  (via drill 0.2)
  Top 0.152: v24.16,11.81 23.7,11.81 23.55,11.66 23.55,11.02 U$1.23 | v17.83,12.88 17.83,13.02 arc-90 Q3.6
  Bottom 0.152: v17.83,12.88 19.13,12.88 arc-90 19.58,12.42 19.58,11.81 arc90 19.89,11.51 21.72,11.51 arc90 21.95,11.73 21.95,12.19 arc-90 22.25,12.5 23.47,12.5 v24.16,11.81
GPIO2  (via drill 0.2)
  Top 0.152: U$1.22 24.07,10.66 v24.44,10.29
  Bottom 0.152: U$3.P$4 9.09,2.5 arc90 8.46,3.12 8,3.12 arc-90 7.54,3.58 7.54,5.41 arc90 7.09,5.87 arc-90 6.55,6.4 6.55,11.05 arc-90 7.01,11.51 7.09,11.51 arc90 7.37,11.79 7.37,12.17 arc-90 8,12.8 9.83,12.8 arc90 10.13,13.11 10.13,13.18 arc-90 10.36,13.41 13.56,13.41 arc-90 13.95,13.03 arc90 14.18,12.8 15.85,12.8 arc-90 16.08,12.57 16.08,11.73 arc90 16.31,11.51 19.18,11.51 19.51,11.17 22.05,11.17 22.33,11.45 22.33,11.83 22.69,12.19 23.24,12.19 23.62,11.81 23.62,11.1 v24.44,10.29
GPIO4  (via drill 0.2)
  Top 0.152: U$1.24 23.07,11.68 v23.01,11.73
  Bottom 0.152: v23.01,11.73 22.17,10.89 19.4,10.89 19.07,11.22 15.79,11.22 15.79,11.23 arc-90 15.54,11.47 15.54,12.19 arc90 15.22,12.52 8.25,12.52 arc90 8,12.27 8,6.9 arc90 8.02,6.88 9.6,5.3 9.6,3.43 arc90 10.13,2.9 10.97,2.9 arc-90 11.63,2.24 U$3.P$5
GPIO5
  Top 0.152: U$1.34 21.99,5.92 21.95,5.87 21.95,1.53 U$3.P$9
GPIO7  (via drill 0.2)
  Top 0.152: v23.16,6.67 22.91,6.92 U$1.32
  Bottom 0.152: IC1.3 22.54,7.29 v23.16,6.67
GPIO8  (via drill 0.2)
  Top 0.152: v23.15,6.06 22.8,6.42 U$1.33 21.81,6.42 arc90 21.44,6.05 21.44,5.43 arc-90 21.04,5.03 21.03,5.03 arc90 20.65,4.65 20.65,4.19 arc-90 20.12,3.66 16.38,3.66 arc-90 16.08,3.96 v16.08,5.03
  Bottom 0.152: v16.08,5.03 16.08,5.72 IC1.5
GPIO10  (via drill 0.2)
  Top 0.152: U$1.29 21.68,8.41 21.49,8.61 v21.49,9.19
  Bottom 0.152: v21.49,9.19 21.49,9.74 IC1.1
GPIO11  (via drill 0.2)
  Top 0.152: 22.63,7.92 U$1.30 23.23,7.92 23.24,7.92 23.24,8.37 v23.16,8.45
  Bottom 0.152: IC1.7 17.55,8.56 arc90 17.75,8.76 17.75,9.75 arc-90 18.06,10.06 19.22,10.06 19.49,10.33 23.2,10.33 arc-90 23.32,10.21 23.32,9.98 arc90 23.55,9.75 arc-90 24,9.3 24,8.45 v23.16,8.45 23.23,8.45
GPIO12
  Top 0.152: U$1.18 26.07,11.73 25.35,12.45 25.35,14.45 25.63,14.73 26.34,14.73 26.63,14.44 L2.3
GPIO13
  Top 0.152: U$1.20 25.07,14.49 24.04,15.52 21.33,15.52 21.31,15.54 19.51,15.54 arc-90 19.25,15.81 U$2.P$8
GPIO14  (via drill 0.2)
  Top 0.152: U$1.17 26.57,11.76 25.83,12.5 v25.83,14.33
  Bottom 0.152: v25.83,14.33 25.83,14.78 arc90 25.53,15.09 16.99,15.09 arc-90 16.69,15.39 16.69,16.59 arc-90 U$2.P$7
GPIO15
  Top 0.152: U$1.21 24.57,12.22 24.76,12.42 24.76,14.41 23.93,15.24 19.11,15.24 18.96,15.39 15.39,15.39 U$2.P$6
GPIO17  (via drill 0.2)
  Top 0.152: v23.16,9.37 22.53,9.37 U$1.27
  Bottom 0.152: IC1.2 22.01,8.99 22.78,8.99 v23.16,9.37
GPIO18  (via drill 0.2)
  Top 0.152: U$1.35 23.07,5.42 v23.15,5.5 | U$3.P$8 arc90 19.28,1.4 19.28,2.44 arc-90 19.74,2.9 21.18,2.9 arc90 21.67,3.38 21.67,4.28 arc90 21.3,4.65 v21.26,4.65
  Bottom 0.152: v21.26,4.65 22.11,5.5 v23.15,5.5
GPIO19  (via drill 0.2)
  Top 0.152: U$1.38 23.57,2.69 arc-90 v23.24,2.36
  Bottom 0.152: U$3.P$6 14.17,1.9 arc-90 14.86,2.59 23.01,2.59 arc-90 v23.24,2.36
GPIO21  (via drill 0.2)
  Top 0.152: U$1.42 25.57,3.69 26.09,3.17 v26.09,3.09
  Bottom 0.152: 26.05,3.09 v26.09,3.09 arc-90 24.37,1.37 U$3.P$10
GPIO22
  Top 0.152: U$1.39 24.07,2.83 arc90 24.23,2.67 26.44,2.67 arc-90 26.87,2.24 U$3.P$11
GPIO23  (via drill 0.2)
  Top 0.152: v22.4,4.27 22.49,4.36 U$1.36 | U$3.P$7 16.71,2.46 arc-90 17.53,3.28 20.65,3.28 arc90 21.26,3.89 v21.26,4.12
  Bottom 0.152: v22.4,4.27 22.25,4.12 v21.26,4.12
GPIO25  (via drill 0.2)
  Top 0.152: v28.01,10.3 28.01,10.33 28.12,10.44 28.12,10.94 U$1.14
  Bottom 0.152: v28.01,10.3 28.01,13.14 arc90 27.51,13.64 25.45,13.64 arc-90 25.22,13.87 25.22,14.63 arc90 25.04,14.81 12.24,14.81 arc-90 11.66,15.39 11.66,16.58 arc90 U$2.P$5
GPIO26  (via drill 0.2)
  Top 0.152: 27.55,11.01 U$1.15 27.57,10.47 v27.4,10.3
  Bottom 0.152: v27.4,10.3 27.4,12.68 arc90 26.75,13.34 25.15,13.34 arc-90 24.84,13.64 24.84,14.33 arc90 24.64,14.53 9.86,14.53 arc-90 9.22,15.16 9.22,16.48 arc90 U$2.P$4
GPIO27  (via drill 0.2)
  Top 0.152: 27.07,10.91 U$1.16 27.07,10.72 v26.65,10.3
  Bottom 0.152: v26.65,10.3 26.52,10.43 26.52,12.34 arc90 25.91,12.95 24.69,12.95 arc-90 24.46,13.18 24.46,14.02 arc90 24.23,14.25 7.39,14.25 arc-90 6.63,15.01 6.63,16.15 arc90 6.55,16.24 U$2.P$3
GPIO32  (via drill 0.2)
  Top 0.152: U$1.12 29.15,11.54 29.41,11.81 29.41,15.01 arc90 29.03,15.39 25.91,15.39 arc-90 v25.68,15.62
  Bottom 0.152: v25.68,15.62 25.43,15.37 22.05,15.37 arc-90 21.72,15.7 21.72,16.54 arc-90 U$2.P$9
GPIO33
  Top 0.152: U$1.13 28.57,11.65 29.03,12.12 29.03,14.78 arc90 28.8,15.01 25.22,15.01 24.33,15.91 U$2.P$10
IN
  Top 0.305: T1.2 8.99,14.79 | 8.99,14.79 10.96,14.79 11.21,14.54 D1.C 12.42,14.08 | 12.42,14.08 12.82,14.08 13.08,13.82 U$4.P$3 | U$4.P$4 12.37,14.03 12.42,14.08 | 8.99,14.79 8.99,13.32 C3.1
N$1
  Top 0.305: LED2.A 11.93,6.55 R5.1
N$2
  Bottom 0.305: IC1.8 15.23,9.83 14.68,9.27 JP1.2
N$4
  Top 0.152: 18.9,13.46 Q3.5 18.91,13.95 19.13,14.17 20.58,14.17 R10.1
N$5
  Top 0.305: R6.2 13.88,13.73 14.02,13.87 15.02,13.87 U4.5
N$6
  Top 0.305: LED1.A 13.76,6.15 R4.1
N$7
  Top 0.152: Q3.2 18.91,12.05 19,12.14 20.57,12.14 R11.1
N$11
  Top 0.305: U$1.2 30.18,5.42 arc90 30.63,5.87 30.63,7.14 arc-90 C8.1 32.45,8.04 arc90 L1.2
N$12
  Top 0.305: C7.1 arc90 34.37,8.06 L1.1 33.49,11.75 arc90 ANT1.1
N$16
  Top 0.203: 8.86,11.77 R12.2 8.26,11.77 7.95,11.46 7.95,10.24 7.49,9.78 J3.B7
  Top 0.254: J3.B7 5.59,9.78 arc90 5.33,9.53 5.33,9.07 arc90 5.64,8.76 6.65,8.76 arc90 J3.A7
N$33  (1 unrouted)
  Top 0.203: R13.2 8.41,11.01 8.28,10.87 8.28,10.02 7.54,9.28 J3.A6
N$34
  Top 0.203: J3.A5 7.38,10.28 7.62,10.52 7.62,12.19 7.96,12.53 R2.2
N$35
  Top 0.203: R1.2 7.77,9.04 7.77,7.62 7.43,7.28 J3.B5
RESET  (via drill 0.2)
  Top 0.152: 29.15,8.87 U$1.9 28.8,8.91 28.47,8.58 v28.47,7.72 28.5,7.75 | C9.1 22.3,12.98 | 22.3,12.98 22.3,12.62 arc-90 22.17,12.5 arc90 21.95,12.27 21.95,11.73 arc-90 21.64,11.43 19.73,11.43 arc-90 Q3.3 | 22.3,12.98 22.3,13.05 R9.1 22.75,13.56 v22.73,13.56
  Top 0.305: S1.3 8.72,7.28 v8.69,7.24
  Bottom 0.152: v22.73,13.56 22.81,13.56 24.1,12.27 24.61,12.27 arc-90 24.99,11.89 24.99,9.91 arc90 25.3,9.6 28.29,9.6 28.32,9.57 28.6,9.57 28.84,9.34 28.84,8.09 arc-90 v28.47,7.72 | v8.69,7.24 9.75,7.24 arc-90 9.98,7.01 9.98,5.56 arc90 10.52,5.03 10.67,5.03 arc-90 10.97,4.72 arc90 11.28,4.42 12.57,4.42 arc-90 12.88,4.12 12.88,3.28 arc90 13.28,2.87 23.3,2.87 23.66,2.52 24.94,2.52 25.93,3.5 26.51,3.5 arc90 26.9,3.89 arc-90 28.22,5.21 28.47,5.21 | 28.45,7.7 arc90 v28.47,7.72 | 28.47,5.21 arc90 28.88,4.8 arc-90 29.34,4.34 29.34,1.44 arc90 U$3.P$12 | v28.47,7.72 28.47,5.21
RTS  (via drill 0.2)
  Top 0.152: R11.2 21.47,13.56 20.04,13.56 | v20.04,13.11 20.04,13.56 | 18.68,12.8 18.75,12.8 | 18.75,12.8 19.03,12.8 arc90 19.56,13.33 Q3.4 19.67,13.56 20.04,13.56 | 18.75,12.8 arc90 17.75,11.81 17.75,10.52 arc90 18.21,10.06 19.89,10.06 arc-90 20.19,9.75 20.19,8.88 arc-90 U1.19
  Bottom 0.152: v20.04,13.11 21.18,13.11 arc-90 21.41,12.88 21.41,12.04 arc90 v21.49,11.96
RXD  (via drill 0.2)
  Top 0.152: v24.54,3.2 24.54,4.3 U$1.40 | v18.82,9.6 arc-90 19.15,9.27 U1.21
  Bottom 0.152: v18.82,9.6 19.13,9.3 19.13,3.81 arc90 19.51,3.43 24.31,3.43 arc-90 v24.54,3.2
SENSOR_VN  (via drill 0.2)
  Top 0.152: U$1.8 v29.82,8.41
  Bottom 0.152: U$2.P$12 arc-90 29.64,16.38 29.64,8.59 arc90 v29.82,8.41
SENSOR_VP  (via drill 0.2)
  Top 0.152: v29.87,7.01 29.77,6.92 U$1.5
  Bottom 0.152: v29.87,7.01 arc-90 29.34,7.54 29.34,14.14 arc90 28.64,14.84 27.37,14.84 arc-90 26.9,15.32 26.9,16.58 arc90 U$2.P$11
TXD  (via drill 0.2)
  Top 0.152: U1.20 19.65,9.53 v19.58,9.6 | v25.07,3.66 U$1.41
  Bottom 0.152: v19.58,9.6 arc90 19.51,9.53 19.51,4.01 arc90 19.81,3.71 25.02,3.71 arc-90 v25.07,3.66
V_BATT  (via drill 0.2)
  Top 0.305: R7.2 13.03,9.53 | 13.03,9.53 C4.1 | 13.03,9.53 13.11,9.46 13.11,9.04 13.7,9.04 14.03,8.71 16.22,8.71 16.54,9.03 16.82,9.03 16.98,9.19 16.98,11.08 U4.3 17.04,11.84 v16.76,12.12 | U$2.P$1 1.47,15.37 arc90 2.29,14.55 4.5,14.55 arc90 4.88,14.94 arc-90 5.33,15.39 7.32,15.39 arc-90 7.62,15.09 T1.3 arc-90 7.61,14.55
  3.3V 0.813: U$2.P$1 3.45,14.63 3.45,8.82 3.81,8.46 6.63,8.46 8.76,10.59 10.82,10.59 11.51,9.91 13.64,9.91 14.78,8.76 16.46,8.76 16.76,9.07 v16.76,12.12
  Bottom 0.406: CN1.2 3.58,8.46 3.35,8.69 3.35,14.73 U$2.P$1
V_USB  (via drill 0.2)
  Top 0.305: v11.21,12.95 D1.A 11.21,10.81 11.43,10.59 12.26,10.59 C1.1 | 7.85,6.58 8.79,6.58 arc90 9.55,7.34 9.55,8.75 R3.2 | 7.85,6.58 7.75,6.58 | 4.34,3.81 2.29,3.81 arc90 1.68,3.2 1.68,1.58 arc-90 U$3.P$1 | 7.85,6.58 7.85,4.27 7.39,3.81 7.38,3.81 7.12,3.55 5.06,3.55 4.8,3.81 4.34,3.81 | U1.8 18.15,4.21 v18.06,4.12 | T1.1 8.17,14.19 v8.17,13.64 7.54,13.64 7.01,14.17 4.88,14.17 4.34,13.64 4.34,12.04 | R5.2 11.93,3.7 arc-90 v11.89,3.66 | J3.VBUS1 6.12,11.48 5.85,11.21 5.17,11.21 4.34,12.04 | U4.4 17.04,14.5 16.92,14.63 16.08,14.63 15.77,14.33 v15.77,13.79 | 4.34,3.81 4.34,12.04
  Top 0.406: J3.VBUS2 7.75,6.58 v7.77,6.55 | 11.89,4.53 R5.2
  3.3V 0.635: v15.77,13.79 14.93,12.95 13.95,12.95 13.33,13.56 | v8.17,13.64 8.17,14.41 8.61,14.86 12.03,14.86 13.33,13.56 | 13.33,13.56 11.83,13.56 v11.21,12.95
  3.3V 0.813: 9.14,5.18 10.67,3.66 v11.89,3.66 | v18.06,4.12 17.92,4.12 17.29,3.49 15.64,3.49 13.95,5.18 9.14,5.18 | v7.77,6.55 8.41,5.92 8.69,5.92 9.12,5.49 9.12,5.21 9.14,5.18
VDDSDIO  (via drill 0.2)
  Top 0.305: U$1.26 21.55,9.91 arc-90 20.95,10.52 20.95,11 | v18.9,10.82 19.07,11 20.95,11 | 20.95,11 21.74,11 arc90 22.4,11.66 22.4,11.8 arc-90 22.87,12.27 23.85,12.27 arc90 24.31,12.72 C2.1
  Bottom 0.305: JP1.1 14.12,10.08 14.86,10.82 v18.9,10.82